# Altium schematic sheet isoCAN.SchDoc
size A4; CompanyName: Zohm Control GmbH; Address1: Rittersbacher Straße 48c; Address2: 91126 Schwabach; Address3: GERMANY; DocumentNumber: 5; SheetNumber: 11; SheetTotal: 22; Website: www.zohm-control.com
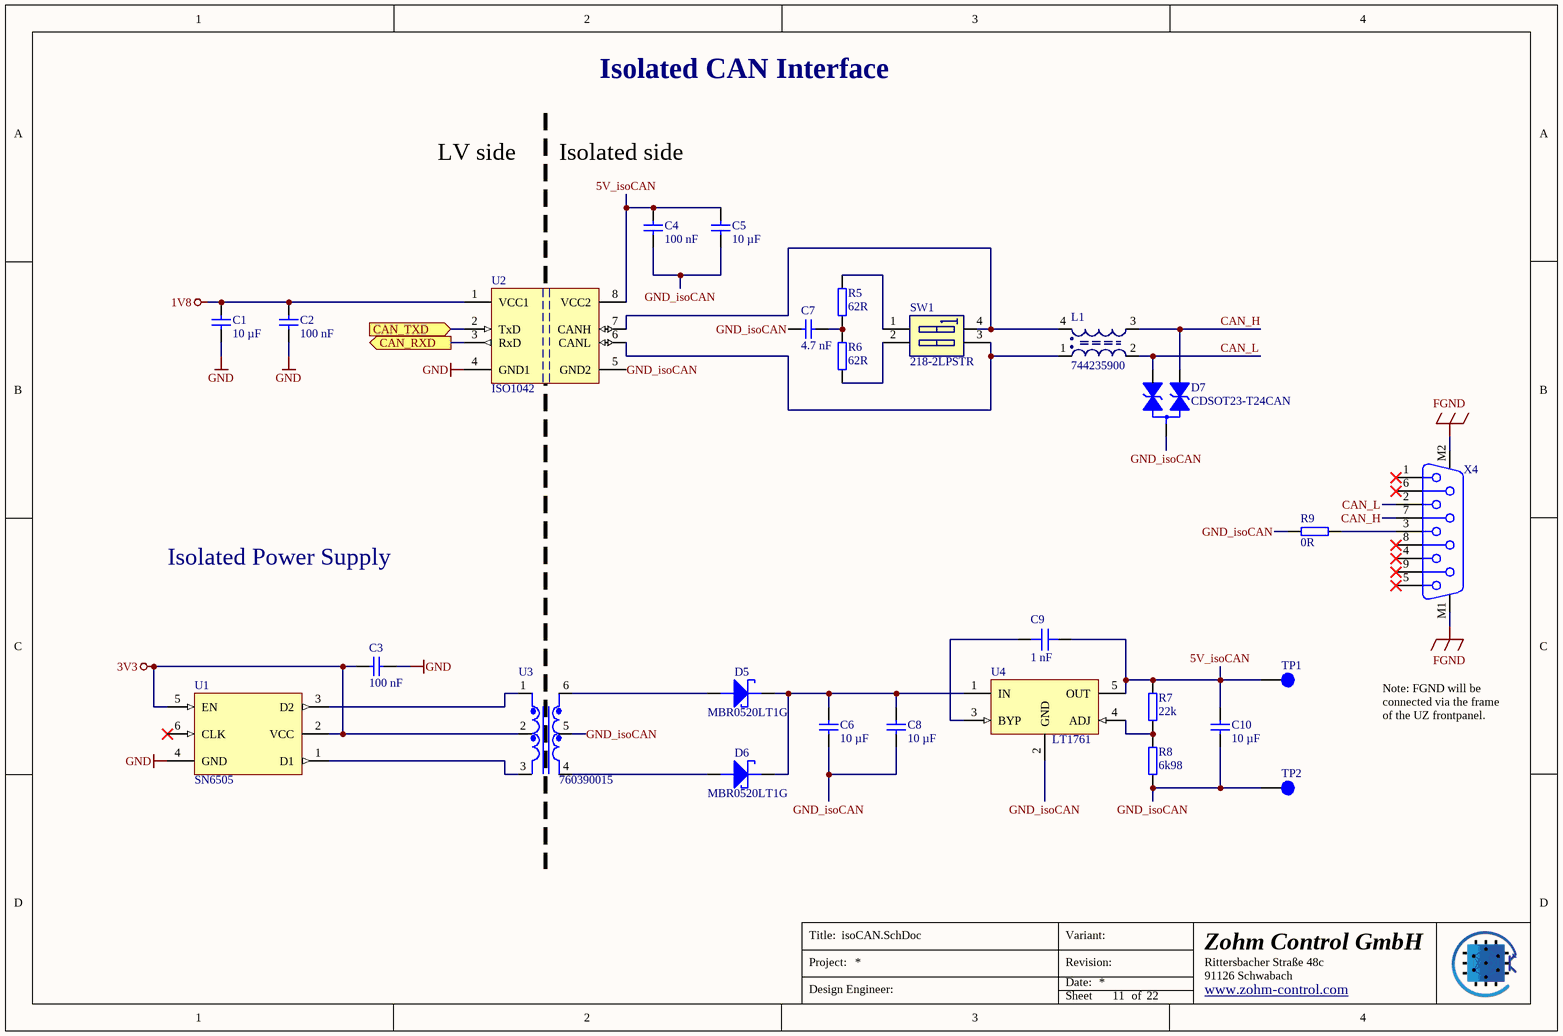
[diagram p0: isoCAN.SchDoc]

## Parts
C1  10 µF  [C_0603_TE]
C2  100 nF  [C_0603_TE]
C3  100 nF  [C_0603_TE]
C4  100 nF  [C_0603_TE]
C5  10 µF  [C_0603_TE]
C6  10 µF  [C_0603_TE]
C7  4.7 nF  [C_0603_TE]
C8  10 µF  [C_0603_TE]
C9  1 nF  [C_0603]
C10  10 µF  [C_0603_TE]
D5  MBR0520LT1G  [SOD3816X120N]
D6  MBR0520LT1G  [SOD3816X120N]
D7  CDSOT23-T24CAN  [SOT95P237X112-3N]
L1  744235900  [WE-CNSW-1812]
R5  62R  [R_0603_TE]
R6  62R  [R_0603_TE]
R7  22k  [R_0603_TE]
R8  6k98  [RES 0603_1608]
R9  0R  [R_0603_TE]
SW1  218-2LPSTR  [2182LPSTR]
TP1  Testpoint 1mm  [TP_1mm]  (value not drawn)  (no BOM)
TP2  Testpoint 1mm  [TP_1mm]  (value not drawn)  (no BOM)
U1  SN6505  [SOT95P280X145-6N]
U2  ISO1042  [SOIC127P1150X280-8L50N]
U3  760390015  [760390015]
U4  LT1761  [SOT23-5_N]
X4  D-SUB 9, female  [618009231121]  (value not drawn)

## Ports
CAN_RXD (out), CAN_TXD (in)

## Nets
1V8: C1.2 C2.2 U2.1(VCC1)
3V3: C3.2 U1.2(VCC) U1.5(EN) U3.2
FGND: X4.M1 X4.M2
GND: C1.1 C2.1 C3.1 U1.4(GND) U2.4(GND1)
5V_isoCAN: C4.2 C5.2 C9.2 C10.2 R7.2 TP1.1 U2.8(VCC2) U4.5(OUT)
CAN_H: D7.1(cathode_1) L1.3 X4.7
CAN_L: D7.2(cathode_2) L1.2 X4.2
CAN_RXD: U2.3(RxD) ; port CAN_RXD
CAN_TXD: U2.2(TxD) ; port CAN_TXD
GND_isoCAN: C4.1 C5.1 C6.1 C7.2 C8.1 C10.1 D7.3(common_cathode) R8.1 R9.1 TP2.1 U2.5(GND2) U3.5 U4.2(GND)
NetC6_2: C6.2 C8.2 D5.1(KATHODE) D6.1(KATHODE) U4.1(IN)
NetC7_1: C7.1 R5.1 R6.2
NetC9_1: C9.1 U4.3(BYP)
NetD5_2: D5.2(ANODE) U3.6
NetD6_2: D6.2(ANODE) U3.4
NetL1_1: L1.1 SW1.3 U2.6(CANL)
NetL1_4: L1.4 SW1.4 U2.7(CANH)
NetR5_2: R5.2 SW1.1
NetR6_1: R6.1 SW1.2
NetR7_1: R7.1 R8.2 U4.4(ADJ)
NetR9_2: R9.2 X4.3
NetU1_1: U1.1(D1) U3.3
NetU1_3: U1.3(D2) U3.1

Not connected (* = marked no-connect by the designer): U1 6(CLK)*; X4 1* 4* 5* 6* 8* 9*

## Notes on the sheet
- Isolated CAN Interface
- LV side
- Isolated side
- Isolated Power Supply
- Note: FGND will be connected via the frame of the UZ frontpanel.
- Title:
- Project:
- Date:
- Revision:
- Variant:
- Design Engineer:
- Sheet
- of

## Library data of the parts
C1 C5 C6 C8 C10 = UZgen_C_0603_10uF_16V_X7R: Generic capacitor; Manufacturer: UZgen; Tolerance: 10 %; Created from: UZgenTool; Voltage: 16V; Manufacturer Part Number: UZgen_C_0603_10uF_16V_X7R; PartID: 3807; Created On: 02/08/2024 11:17:59; Device Package: 0603; Last Updated: 02/08/2024 11:17:59; Mounting Type: SMD; Value: 10 µF; Technology: X7R
C2-C4 = UZgen_C_0603_100nF_50V_X7R: Generic capacitor; Manufacturer: UZgen; Tolerance: 10 %; Created from: AGeiger; Voltage: 50V; Manufacturer Part Number: UZgen_C_0603_100nF_50V_X7R; PartID: 1; Created On: 02/07/2024 14:42:23; Device Package: 0603; Last Updated: 08/08/2024 15:01:15; Mounting Type: SMD; Value: 100 nF; Technology: X7R
C7 = UZgen_C_0603_4.7nF_50V_X7R: Generic capacitor; Manufacturer: UZgen; Tolerance: 10 %; Created from: UZgenTool; Voltage: 50V; Manufacturer Part Number: UZgen_C_0603_4.7nF_50V_X7R; PartID: 4255; Created On: 02/08/2024 11:18:09; Device Package: 0603; Last Updated: 02/08/2024 11:18:09; Mounting Type: SMD; Value: 4.7 nF; Technology: X7R
C9 = CC0603JRNPO9BN102: Capacitor 0603, 50 VDC, 1 nF, NP0; Manufacturer: YAGEO; Tolerance: 5 %; Voltage Rating: 50 VDC; Created from: AGeiger; Manufacturer Part Number: CC0603JRNPO9BN102; PartID: 104; Created On: 30.08.2022 11:46:28; ComponentLink1Description: Datasheet; ComponentLink1URL: https://datasheet.lcsc.com/lcsc/1811021411_YAGEO-CC0603JRNPO9BN102_C106246.pdf; Component Type: Capacitor 0603; Device Package: 0603; Last Updated: 30.08.2022 11:46:28; Mounting Type: SMD; Operating Temperature: -55 - 125°C; Series: NP0; Supplier 1: LCSC; Supplier Part Number 1: C106246; Type: Capacitor; Value: 1 nF; Live Cycle Status: 1; LCSC Part Number: C106246
D5 D6 = MBR0520LT1G: Schottky Diodes & Rectifiers 0.5A 20V; Manufacturer: onsemi; AN: 26768; Mixed: SMT; Extra: AEC−Q101; Type: Power Schottky Rectifier; Reverse Current: 250 uA; Created from: FRosner; Value: -; Case: SOD123-FC; Voltage: 0.5A; HelpURL: B:\AD\adlib\datasheet\MBR0520; H-ART: MBR0520LT1G; Manufacturer Part Number: MBR0520LT1G; LCSC Part Number: C23848; PartID: 15; Created On: 10.06.2024 16:38:30; ComponentLink1Description: Datasheet; ComponentLink1URL: https://www.mouser.de/datasheet/2/308/1/MBR0520LT1_D-2315148.pdf; Component Type: Power Schottky Rectifier; Device Package: SMD; Last Updated: 22.08.2024 08:31:16; Mounting Type: SMD; Operating Temperature: -65 to +125 °C; Series: MBR0520L; Supplier 1: Mouser; Supplier Part Number 1: 863-MBR0520LT1G; Supplier 2: LCSC; Supplier Part Number 2: C23848; Forward Current: 0.5 A; Forward Voltage: 20V; Live Cycle Status: 1; Stock number: not stored
D7 = CDSOT23-T24CAN: ESD Protection Diodes / TVS Diodes SOT-23 24V CANbus; Manufacturer: Bourns; Type: TVS-Diode; Power Dissipation: 500 W; Value: TVS, 24 V; Created from: AGeiger; Manufacturer Part Number: CDSOT23-T24CAN; PartID: 18; Created On: 22.08.2024 08:08:03; ComponentLink1Description: Datasheet; ComponentLink1URL: https://www.mouser.de/datasheet/2/54/cdsot23_t24can_q-1534349.pdf; Component Type: TVS Diode, ESD; Device Package: SOT-23-3; Last Updated: 22.08.2024 08:08:03; Mounting Type: SMD; Operating Temperature: -55 to +150 °C; Supplier 1: Mouser; Supplier Part Number 1: 652-CDSOT23-T24CAN; Supplier 2: LCSC; Supplier Part Number 2: C2959841; Live Cycle Status: 1; LCSC Part Number: C2959841
L1 = 744235900: Common Mode Chokes / Filters WE-CNSW 1812 2000mA 0.3uH 100kHz AECQ200; Manufacturer: Wuerth Elektronik; Type: Inductance SMD; DC current: 2 A; Value: 50 mOhm; Created from: MGremer; Manufacturer Part Number: 744235900; PartID: 2; Created On: 18.01.2021 14:53:17; ComponentLink1Description: Datasheet; ComponentLink1URL: https://www.mouser.de/datasheet/2/445/744235900-1721392.pdf; Component Type: Inductance; Device Package: 1812; Last Updated: 22.08.2024 11:15:33; Mounting Type: SMD; Operating Temperature: -40 to +125 °C; Series: WE-CNSW; Supplier 1: Mouser; Supplier Part Number 1: 710-744235900; Live Cycle Status: 1; Stock number: not stored
R5 R6 = UZgen_R_0603_62R: Generic resistor; Manufacturer: UZgen; Tolerance: 1 %; Created from: UZgenTool; Manufacturer Part Number: UZgen_R_0603_62R; PartID: 192; Created On: 02/07/2024 17:29:48; Device Package: 0603; Last Updated: 02/07/2024 17:29:48; Mounting Type: SMD; Value: 62R
R7 = UZgen_R_0603_22k: Generic resistor; Manufacturer: UZgen; Tolerance: 1 %; Created from: UZgenTool; Manufacturer Part Number: UZgen_R_0603_22k; PartID: 252; Created On: 02/07/2024 17:29:50; Device Package: 0603; Last Updated: 02/07/2024 17:29:50; Mounting Type: SMD; Value: 22k
R8 = RC0603FR-076K98L: SMD resistor 1%; Manufacturer: YAGEO; Created from: AGeiger; Manufacturer Part Number: RC0603FR-076K98L; PartID: 268; Created On: 01.06.2023 17:28:06; ComponentLink1Description: Datasheet; ComponentLink1URL: https://datasheet.lcsc.com/lcsc/2304140030_YAGEO-RC0603FR-076K98L_C137686.pdf; Component Type: SMD resistor; Device Package: 0603; Last Updated: 01.06.2023 17:28:06; Mounting Type: SMD; Supplier 1: LCSC; Supplier Part Number 1: C137686; Type: Resistor; Tolerance: 1%; Value: 6k98; Live Cycle Status: 1; LCSC Part Number: C137686
R9 = UZgen_R_0603_0R: Generic resistor; Manufacturer: UZgen; Tolerance: 1 %; Created from: UZgenTool; Manufacturer Part Number: UZgen_R_0603_0R; PartID: 581; Created On: 08.07.2024 14:34:30; Value: 0R; Device Package: 0603; Mounting Type: SMD; Last Updated: 08.07.2024 14:34:30
SW1 = 218-2LPSTR: DIP Switches/SIP Switches SPST 2 switch sections; Manufacturer: CTS Electronic Components; Created from: AGeiger; Manufacturer Part Number: 218-2LPSTR; PartID: 44; Created On: 23.08.2024 11:42:29; ComponentLink1Description: Datasheet; ComponentLink1URL: https://www.mouser.de/datasheet/2/96/CTS_Switches_DIP_218_Series_Datasheet-1144897.pdf; Component Type: DIP Switch; Device Package: SMD-4P,3.7x5.8mm; Last Updated: 23.08.2024 11:42:29; Mounting Type: SMD; Operating Temperature: -55 to +85 °C; Supplier 1: Mouser; Supplier Part Number 1: 774-2182LPSTR; Supplier 2: LCSC; Supplier Part Number 2: C2961921; Type: Dip Switch 2p; Value: 218-2LPSTR; Live Cycle Status: 1; LCSC Part Number: C2961921
TP1 TP2 = NULL: Manufacturer Part Number: NULL; Created from: AGeiger; Created: 2018_06_25_AGeiger; Value: Testpoint 1mm; PartID: 9; Created On: 20.09.2022 13:14:57; Component Type: Testpoint; Last Updated: 20.09.2022 13:15:39; Manufacturer: NULL; Supplier 1: NULL; Supplier Part Number 1: NULL; Type: Testpoint; Live Cycle Status: 1
U1 = SN6505BDBVR: Low-Noise 1-A Transformer Drivers for Isolated Power Supplies; Manufacturer: Texas Instruments; Created from: MGremer/AGeiger/MGeier; Manufacturer Part Number: SN6505BDBVR; PartID: 40; Created On: 25/08/2024 13:51:34; ComponentLink1Description: Datasheet; ComponentLink1URL: https://www.ti.com/lit/ds/symlink/sn6505b.pdf; Component Type: PMIC Auto Transformer Dvr; Device Package: SOT-23-6; Last Updated: 25/08/2024 13:51:34; Mounting Type: SMD; Operating Temperature: –55°C to 125°C; Series: SN650x; Supplier 1: LCSC; Supplier Part Number 1: C74518; Type: Power Management Specialised - PMIC; Value: SN6505; Live Cycle Status: 1; LCSC Part Number: C74518; Stock number: not stored
U2 = ISO1042BDWVR: CAN Interface IC Isolated CAN transceiver with 70-V bus fault protection & flexible data rate 8-SOIC -40 to 125; Manufacturer: Texas Instruments; Created from: AGeiger; Manufacturer Part Number: ISO1042BDWVR; PartID: 9; Created On: 22/08/2024 07:19:44; ComponentLink1Description: Datasheet; ComponentLink1URL: https://www.ti.com/lit/ds/symlink/iso1042.pdf?ts=1724307386270&ref_url=https%253A%252F%252Fwww.mouser.de%252F; Component Type: Isolated CAN Transceiver; Device Package: SOIC-8; Last Updated: 23/08/2024 14:39:31; Mounting Type: SMD; Operating Temperature: -40 to +125 °C; Supplier 1: Mouser; Supplier Part Number 1: 595-ISO1042BDWVR; Type: CAN Transceiver; Value: ISO1042; Live Cycle Status: 1; Stock number: not stored; LCSC Part Number: C484409
U3 = 760390015: MID-PPTI Push-Pull Transformers for Texas Instruments; belongs to SN74AVC4T774RSVR; Manufacturer: Wuerth Elektronik; Created from: MGremer; Manufacturer Part Number: 760390015; PartID: 6; Created On: 30.11.2020 14:07:02; ComponentLink1Description: Datasheet; ComponentLink1URL: https://www.mouser.de/datasheet/2/445/760390015-221218.pdf; Component Type: Push-Pull Transformer; Device Package: Divers; Last Updated: 22.08.2024 11:23:37; Mounting Type: SMD; Supplier 1: Mouser; Supplier Part Number 1: 710-760390015; Supplier 2: Digi-Key; Supplier Part Number 2: 732-4459-1-ND; Type: Push-Pull Transformer; Live Cycle Status: 1; LCSC Part Number: C249186; Stock number: not stored
U4 = LT1761ES5-BYP#TRPBF: 100mA, Low Noise, LDO Micropower Regulators; Manufacturer: Linear Technology; Created from: MGremer; Manufacturer Part Number: LT1761ES5-BYP#TRPBF; LCSC Part Number: C655161; PartID: 10; Created On: 30.11.2020 13:55:34; ComponentLink1Description: Datasheet; ComponentLink1URL: https://www.analog.com/media/en/technical-documentation/data-sheets/1761sff.pdf; Component Type: LDO Micropower; Device Package: SOT-23-5; Last Updated: 22.08.2024 08:36:30; Mounting Type: SMD; Supplier 1: LCSC; Supplier Part Number 1: C655161; Type: LDO Micropower Regulator; Value: LT1761; Live Cycle Status: 1; Stock number: not stored
X4 = 618009231121: D-Sub Standard Connectors WR-DSUB Female PCB 9Pin Hex Scrw 8.08mm; Manufacturer: Wuerth Elektronik; Contact Resistance: 30mOhm; Rated Current: 3A; Working Voltage: 125VAC; Withstanding Voltage: 1000VAC; Created from: AGeiger; Manufacturer Part Number: 618009231121; Category: Input/Output Connectors; Match Code: WR-DSUB; ComponentLink1Description: Datasheet; ComponentLink1URL: https://www.we-online.com/components/products/datasheet/618009231121.pdf; ComponentLink2Description: Datasheet Link; ComponentLink2URL: https://www.we-online.com/redexpert/spec/618009231121?ad; Mount: Through Hole; Operating Temperature Max: 105°C; Operating Temperature Min: -55°C; Packaging: Tray; Gender: Female; Number of Pins: 9; Orientation: Angled; PartID: 6; Created On: 31.05.2023 13:23:16; Last Updated: 31.05.2023 13:23:16; Mounting Type: THT; Operating Temperature: -40 °C to +85 °C; Series: D-SUB Standard; Supplier 1: Mouser; Supplier Part Number 1: 710-618009231121; Value: D-SUB 9, female; LCSC Part Number: C141882